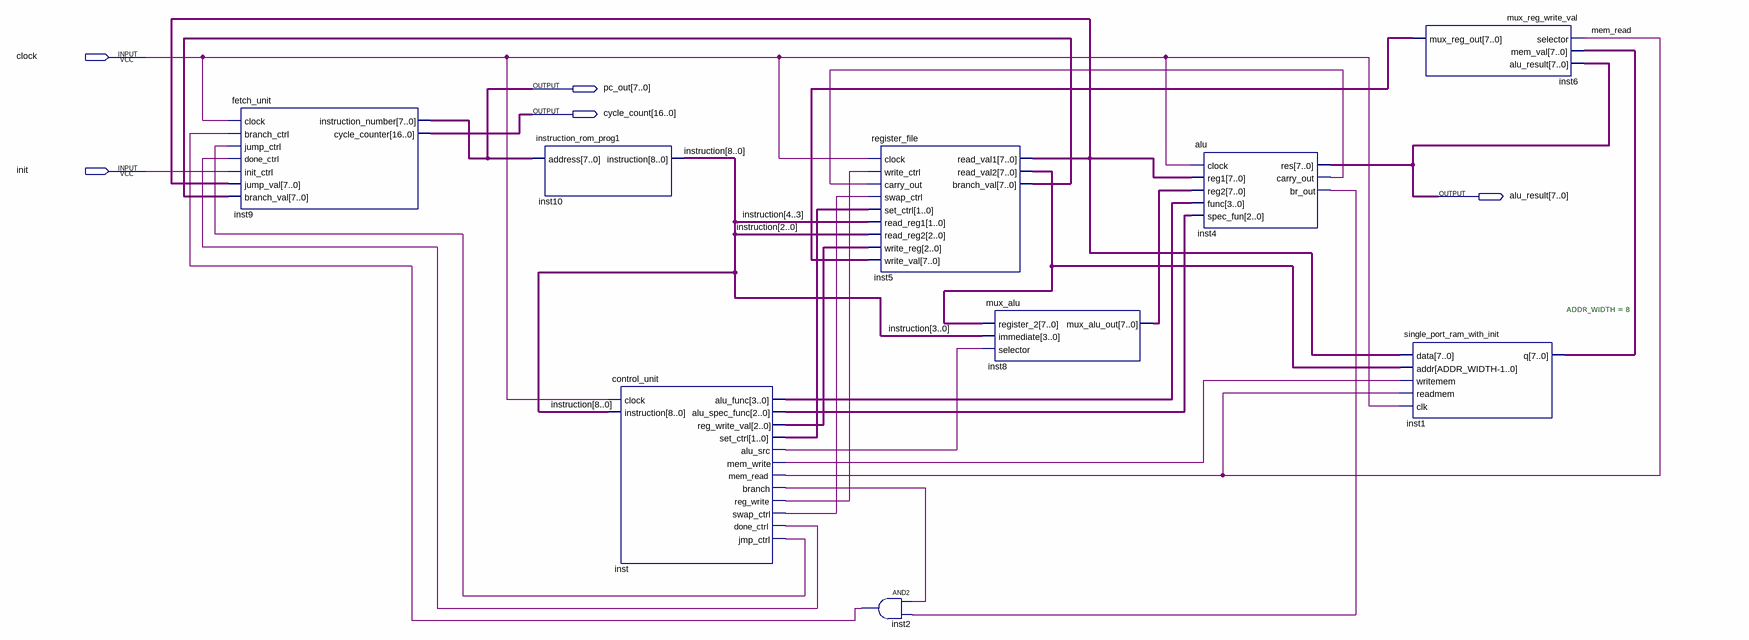
[diagram p0: schematic sheet]
// Quartus schematic Lab3.bdf as structural Verilog: 9 symbols, 5 pins
module Lab3 (
  input  clock,
  input  init,
  output [7:0] pc_out,
  output [16:0] cycle_count,
  output [7:0] alu_result
);

  wire inst2_out, inst4_br_out, inst4_carry_out, inst_alu_src, inst_branch, inst_done_ctrl, inst_jmp_ctrl,
       inst_mem_write, inst_reg_write, inst_swap_ctrl, mem_read;
  wire [1:0] inst_set_ctrl;
  wire [2:0] inst_alu_spec_func, inst_reg_write_val;
  wire [3:0] inst_alu_func;
  wire [7:0] inst1_q, inst5_branch_val, inst5_read_val1, inst5_read_val2, inst6_mux_reg_out,
       inst8_mux_alu_out;
  wire [8:0] instruction;

  fetch_unit inst9 (
    .clock(clock), .branch_ctrl(inst2_out), .jump_ctrl(inst_jmp_ctrl), .done_ctrl(inst_done_ctrl),
    .init_ctrl(init), .jump_val(inst5_read_val1), .branch_val(inst5_branch_val), .instruction_number(pc_out),
    .cycle_counter(cycle_count));
  instruction_rom_prog1 inst10 (.address(pc_out), .instruction(instruction));
  control_unit inst (
    .clock(clock), .instruction(instruction), .alu_func(inst_alu_func), .alu_spec_func(inst_alu_spec_func),
    .reg_write_val(inst_reg_write_val), .set_ctrl(inst_set_ctrl), .alu_src(inst_alu_src),
    .mem_write(inst_mem_write), .mem_read(mem_read), .branch(inst_branch), .reg_write(inst_reg_write),
    .swap_ctrl(inst_swap_ctrl), .done_ctrl(inst_done_ctrl), .jmp_ctrl(inst_jmp_ctrl));
  register_file inst5 (
    .clock(clock), .write_ctrl(inst_reg_write), .carry_out(inst4_carry_out), .swap_ctrl(inst_swap_ctrl),
    .set_ctrl(inst_set_ctrl), .read_reg1(instruction[4:3]), .read_reg2(instruction[2:0]),
    .write_reg(inst_reg_write_val), .write_val(inst6_mux_reg_out), .read_val1(inst5_read_val1),
    .read_val2(inst5_read_val2), .branch_val(inst5_branch_val));
  and inst2 (inst2_out, inst_branch, inst4_br_out);
  mux_alu inst8 (
    .register_2(inst5_read_val2), .immediate(instruction[3:0]), .selector(inst_alu_src),
    .mux_alu_out(inst8_mux_alu_out));
  alu inst4 (
    .clock(clock), .reg1(inst5_read_val1), .reg2(inst8_mux_alu_out), .func(inst_alu_func),
    .spec_fun(inst_alu_spec_func), .res(alu_result), .carry_out(inst4_carry_out), .br_out(inst4_br_out));
  mux_reg_write_val inst6 (
    .selector(mem_read), .mem_val(inst1_q), .alu_result(alu_result), .mux_reg_out(inst6_mux_reg_out));
  single_port_ram_with_init #(.ADDR_WIDTH(8)) inst1 (
    .data(inst5_read_val1), .addr(inst5_read_val2), .writemem(inst_mem_write), .readmem(mem_read),
    .clk(clock), .q(inst1_q));
endmodule
